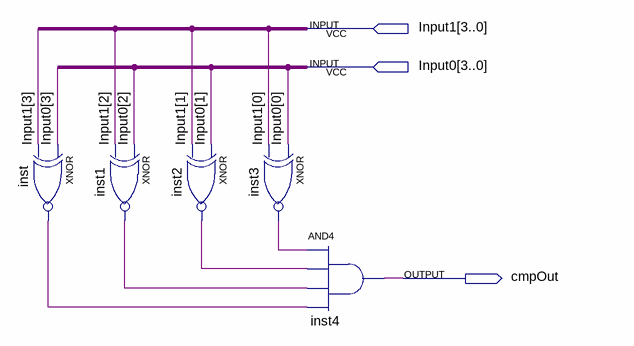
[diagram p0: schematic sheet]
// Quartus schematic EqCmp4.bdf as structural Verilog: 5 symbols, 3 pins
module EqCmp4 (
  input  [3:0] Input1,
  input  [3:0] Input0,
  output cmpOut
);

  wire inst1_out, inst2_out, inst3_out, inst_out;

  xnor inst (inst_out, Input0[3], Input1[3]);
  xnor inst1 (inst1_out, Input0[2], Input1[2]);
  xnor inst2 (inst2_out, Input0[1], Input1[1]);
  xnor inst3 (inst3_out, Input0[0], Input1[0]);
  and inst4 (cmpOut, inst3_out, inst2_out, inst1_out, inst_out);
endmodule
